# Altium schematic sheet camera.SchDoc
size A4
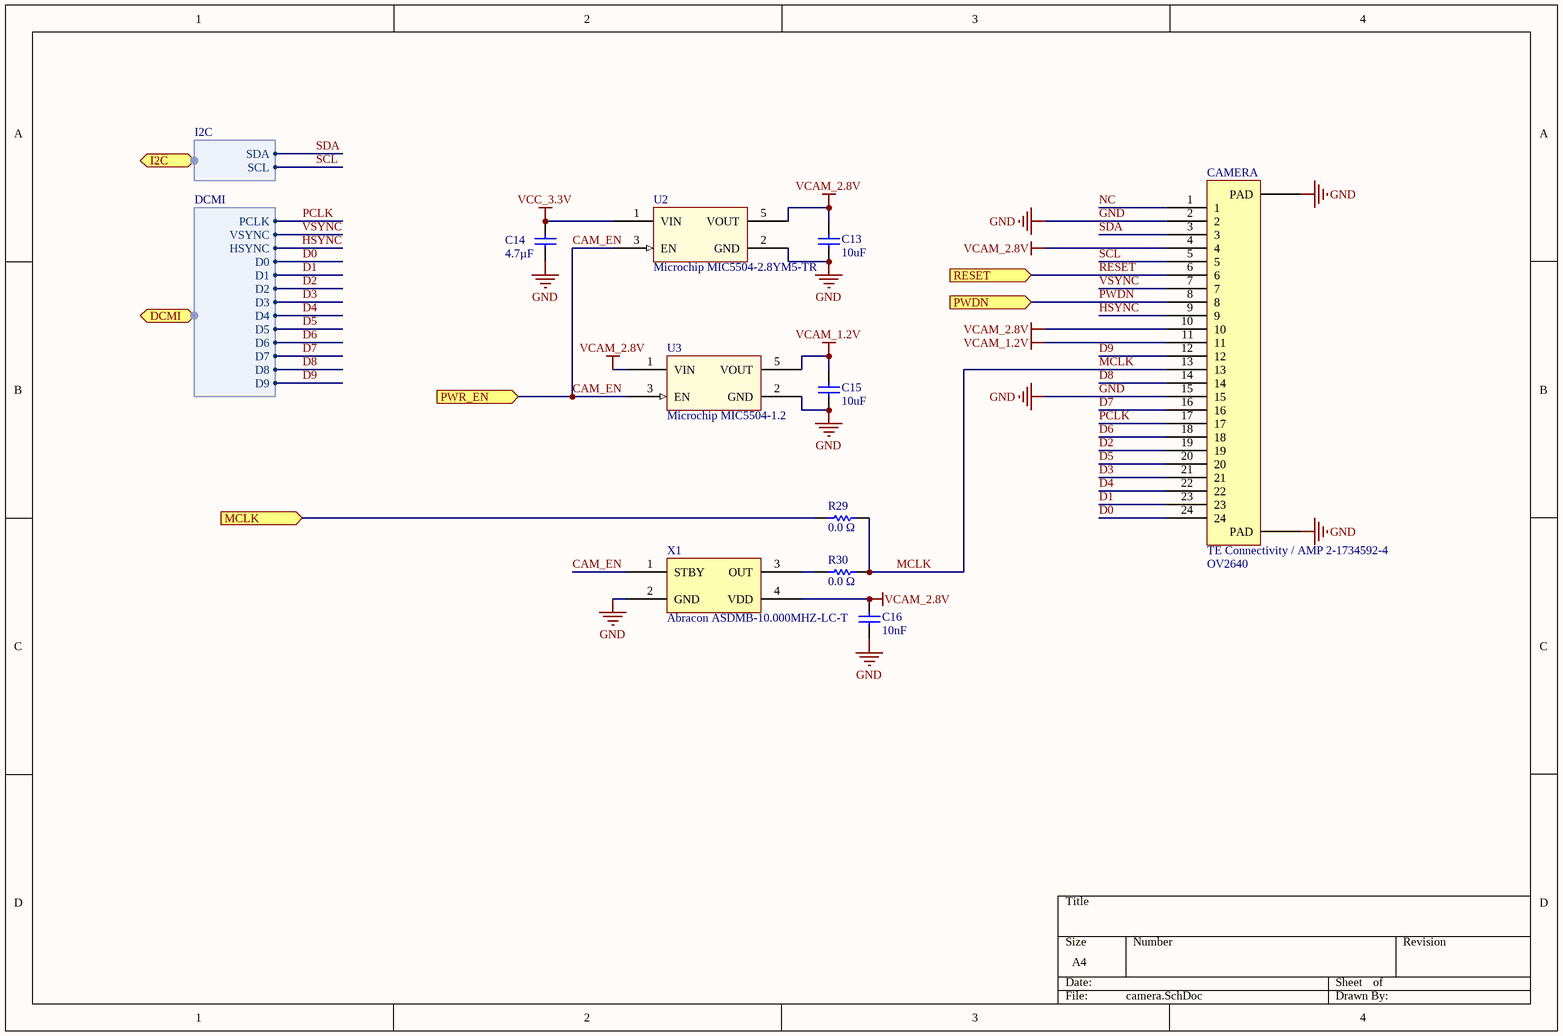
[diagram p0: camera.SchDoc]

## Parts
C13  10uF  [PCB-7x9sd7nowcb4nx8jmhok-1]
C14  4.7µF  [CAPC1608X90X35LL15T15]
C15  10uF  [PCB-7x9sd7nowcb4nx8jmhok-1]
C16  10nF  [RESC1005X40X25LL05T05]
CAMERA  TE Connectivity / AMP 2-1734592-4  [SOP48]
R29  0.0 Ω  [RESC1608X55X25LL10T15]
R30  0.0 Ω  [RESC1608X55X25LL10T15]
U2  Microchip MIC5504-2.8YM5-TR  [PCB-87v9kgqs8q23ekp4z6f0-1]
U3  Microchip MIC5504-1.2  [PCB-87v9kgqs8q23ekp4z6f0-1]
X1  Abracon ASDMB-10.000MHZ-LC-T  [PCB-wrjz21e0na9s1qg4p3ls-1]

## Ports
DCMI (harness DCMI), I2C (harness I2C), MCLK (in), PWDN (in), PWR_EN (in), RESET (in)

## Harnesses
DCMI: PCLK, VSYNC, HSYNC, D0, D1, D2, D3, D4, D5, D6, D7, D8, D9
I2C: SCL, SDA

## Nets
GND: C13.1 C14.1 C15.1 C16.1 CAMERA.2 CAMERA.15 CAMERA.?1(PAD) CAMERA.?2(PAD) U2.2(GND) U3.2(GND) X1.2(GND)
VCAM_1.2V: C15.2 CAMERA.11 U3.5(VOUT)
VCAM_2.8V: C13.2 C16.2 CAMERA.4 CAMERA.10 U2.5(VOUT) U3.1(VIN) X1.4(VDD)
VCC_3.3V: C14.2 U2.1(VIN)
CAM_EN: U2.3(EN) U3.3(EN) X1.1(STBY) ; port PWR_EN
D0: CAMERA.24 ; port DCMI.D0
D1: CAMERA.23 ; port DCMI.D1
D2: CAMERA.19 ; port DCMI.D2
D3: CAMERA.21 ; port DCMI.D3
D4: CAMERA.22 ; port DCMI.D4
D5: CAMERA.20 ; port DCMI.D5
D6: CAMERA.18 ; port DCMI.D6
D7: CAMERA.16 ; port DCMI.D7
D8: CAMERA.14 ; port DCMI.D8
D9: CAMERA.12 ; port DCMI.D9
HSYNC: CAMERA.9 ; port DCMI.HSYNC
MCLK: CAMERA.13 R29.1 R30.1
MCLK: R29.2 ; port MCLK  [a separate net that carries the same name]
NC: CAMERA.1
PCLK: CAMERA.17 ; port DCMI.PCLK
PWDN: CAMERA.8 ; port PWDN
RESET: CAMERA.6 ; port RESET
SCL: CAMERA.5 ; port I2C.SCL
SDA: CAMERA.3 ; port I2C.SDA
VSYNC: CAMERA.7 ; port DCMI.VSYNC
NetR30_2: R30.2 X1.3(OUT)

## Notes on the sheet
- (near CAMERA) OV2640

## Library data of the parts
C13 C15 = CMP-9bf553a3f2f54432-1: 0603 10 uF 10 V ±20 % Tolerance X5R Surface Mount Multilayer Ceramic Capacitor; Lead-Free Status: Lead Free; Capacitance Tolerance: ±20%; Capacitance: 10.0 F; Operating Temperature: -55.0 °C (min); Case/Package: 0603; Dielectric Characteristic: X5R; OctopartID: 9bf553a3f2f54432; Lifecycle Status: Not Listed by Manufacturer; Packaging: Cut Tape (CT)
C14 = CMP-147010-6: 0603 4.7 uF 10 V ±10 % Tolerance X5R SMT Multilayer Ceramic Capacitor; Voltage Rating (DC): 10.0 V; Capacitance Tolerance: ±10%; Lead-Free Status: Lead Free; Capacitance: 4.70 µF; Operating Temperature: -55.0 °C to 85.0 °C; Dielectric Characteristic: X5R; OctopartID: 876b4eec68d658ac; Octopart URL: https://octopart.com/cc0603krx5r6bb475-yageo-9292507; Number of Pins: 2; Mounting Style: Surface Mount; RoHS: Compliant
C16 = CMP-16527022-3: 0.01uF Capacitor; Manufacturer Part Number: 04025C103KAT2A; Capacitance Tolerance: ±10%; Voltage Rating (DC): 50.0 V; Dielectric Characteristic: X7R; Lead-Free Status: Lead Free; Capacitance: 1e-08 F; Octopart Url: https://octopart.com/04025c103kat2a-avx+interconnect+%2F+elco-20614010; OctopartID: 72f7bac7dcebad30; REACH SVHC Compliance: No SVHC; Packaging: Cut Tape (CT); RoHS: Compliant; Case/Package: 0402
CAMERA = CMP-9e32555c798341f5-2: Ffc/Fpc Connector, Receptacle 24 Position 1row, Full Reel
R29 R30 = CMP-3661350-4: Thick Film Resistors - SMD ZERO OHM JUMPER; Voltage Rating (DC): 50.0 V; Lead-Free Status: Lead Free; Resistance Tolerance: ±5%; Octopart Url: https://octopart.com/rc0603jr-130rl-yageo-9297262; Case/Package: 0603; OctopartID: ee3b27bc163331fc; Resistance: 0.0 Ω
U2 = CMP-260decfc55bff9ca-2: Single 300mA LDO with Enable Pull-Down & Auto Discharge 5 SOT-23 T/R RoHS Compliant: Yes; Lifecycle Status: Not Listed by Manufacturer; Manufacturer Part Number: MIC5504-2.8YM5-TR; Octopart URL: https://octopart.com/mic5504-2.8ym5-tr-microchip-66803412; OctopartID: 260decfc55bff9ca; Case/Package: SOT-23
U3 = CMP-260decfc55bff9ca-2: Single 300mA LDO with Enable Pull-Down & Auto Discharge 5 SOT-23 T/R RoHS Compliant: Yes; Manufacturer Part Number: MIC5504-1.2YM5-TR; Lifecycle Status: Not Listed by Manufacturer; Octopart URL: https://octopart.com/mic5504-2.8ym5-tr-microchip-66803412; OctopartID: 260decfc55bff9ca; Case/Package: SOT-23
X1 = CMP-6748af096d52b88f-1: Oscillator MEMS 24MHz Â±50ppm (Stability) 15pF 55% 1.8V/2.5V/3.3V Automotive 4-Pin QFN SMD T/R; Manufacturer Part Number: ASDMB-24.000MHZ-LC-T; Lead-Free Status: Lead Free; Octopart URL: http://octopart.com/asdmb-24.000mhz-lc-t-abracon-21704572; Packaging: Tape & Reel (TR); RoHS: Compliant; OctopartID: 6748af096d52b88f